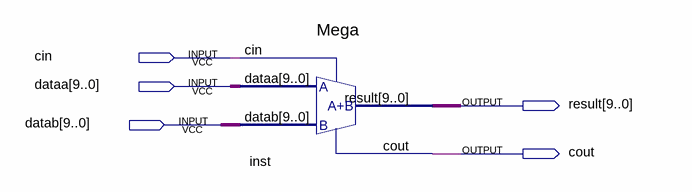
[diagram p0: schematic sheet]
// Quartus schematic Megafunction_Prishchepa.bdf as structural Verilog: 1 symbols, 5 pins
module Megafunction_Prishchepa (
  input  cin,
  input  [9:0] dataa,
  input  [9:0] datab,
  output [9:0] result,
  output cout
);

  Mega inst (.dataa(dataa), .datab(datab), .cin(cin), .result(result), .cout(cout));
endmodule
